# Altium schematic sheet SD_Card_Reader.SchDoc: RP2040 CNC
size B; Author: AM; CompanyName: Expatria Technologies; DrawnBy: A.Marles; Engineer: AM; Organization: Expatria Technolgoies; Address1: 1136 Glade Court; Address3: Port Coquitlam, BC V3B 1R5; Address4: Canada; DocumentNumber: 28; SheetNumber: 28; SheetTotal: 30
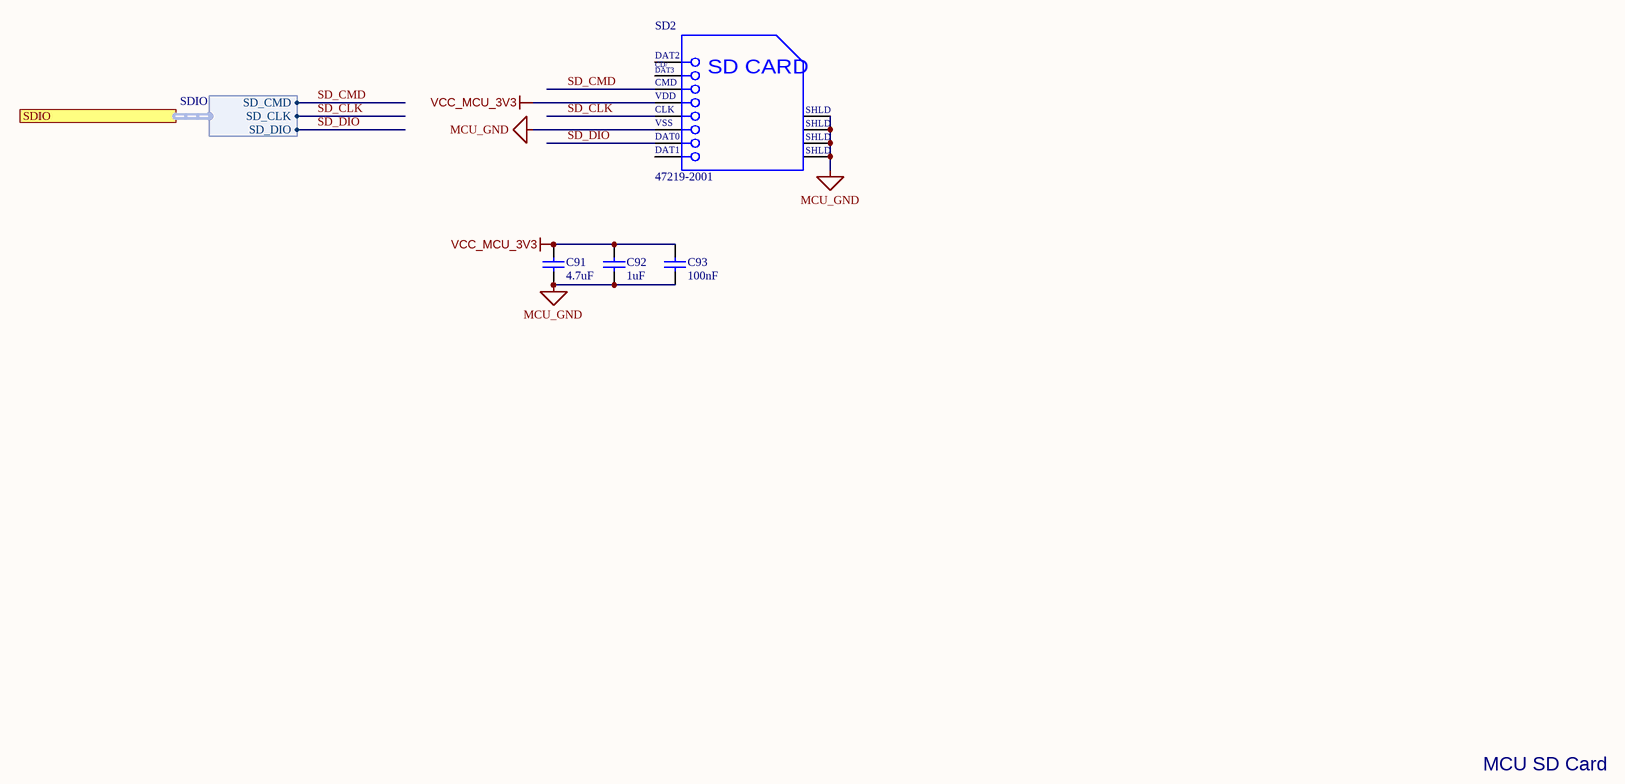
[diagram p0: SD_Card_Reader.SchDoc]

## Parts
C91  4.7uF  [0603_C]
C92  1uF  [0603_C]
C93  100nF  [0603_C]
SD2  47219-2001  [472192001]

## Ports
SDIO (harness SDIO)

## Harnesses
SDIO: SD_CMD, SD_CLK, SD_DIO

## Nets
MCU_GND: C91.1 C92.1 C93.1 SD2.6(VSS) SD2.9(SHLD) SD2.10(SHLD) SD2.11(SHLD) SD2.12(SHLD)
VCC_MCU_3V3: C91.2 C92.2 C93.2 SD2.4(VDD)
SD_CLK: SD2.5(CLK) ; port SDIO.SD_CLK
SD_CMD: SD2.3(CMD) ; port SDIO.SD_CMD
SD_DIO: SD2.7(DAT0) ; port SDIO.SD_DIO

Not connected (* = marked no-connect by the designer): SD2 1(DAT2) 2(CD/DAT3) 8(DAT1)

## Notes on the sheet
- MCU SD Card
- SHEET
- Expatria Technologies
- 1136 Glade Court
- Port Coquitlam, BC V3B 1R5
- PHONE: (778) 238-9336
- PROJECT
- SIZE
- ENGR
- MODIFIED
- DOCUMENT
- REV
- Copyright Expatria Technologies 2022. This document describes Open Hardware and is licensed under the CERN-OHL-S v2. No warranty is implied or expressed.
- EMAIL: info@expatria.ca
- B
- /
- (in symbol 47219-2001) CD/; DAT3; SD CARD

## Library data of the parts
C91 = 0603 4.7uF (475) 10% 16V: Chip capacitors; Manufacturer: Samsung Electro-Mechanics; PartNumber: CL10A475KO8NNNC; Tolerance: 10%; Voltage: 16V; ComponentLink1Description: Supplier link; ComponentLink1URL: http://www.szlcsc.com/product/details_20375.html; Package: 0603; Supplier: LCSC; SuppliersPartNumber: C19666; Capacitance: 4.7uF; Manufacturer Part Number: CL10A475KO8NNNC
C92 = 0603 1uF (105) 10% 50V: Chip capacitors; Manufacturer: Samsung Electro-Mechanics; Manufacturer Part Number: CL10A105KB8NNNC; Tolerance: 10%; Voltage: 50V; ComponentLink1Description: Supplier link; ComponentLink1URL: http://www.szlcsc.com/product/details_16531.html; Package: 0603; Supplier: LCSC; SuppliersPartNumber: C15849; Capacitance: 1uF
C93 = 0603 100nF (104) 10% 50V: Chip capacitors; Manufacturer: YAGEO; Manufacturer Part Number: CC0603KRX7R9BB104; Tolerance: 10%; Voltage: 50V; ComponentLink1Description: Supplier link; ComponentLink1URL: http://www.szlcsc.com/product/details_15331.html; Package: 0603; Supplier: LCSC; SuppliersPartNumber: C14663; Capacitance: 100nF
SD2 = 47219-2001: Conn Micro SD Card SKT 8 POS 1.1mm Solder RA SMD 0.5A/Contact Embossed T/R; Manufacturer: Molex; Manufacturer Part Number 1: 0472192001; Current Rating: 500mA; Number of Contacts: 8; Pitch: 1.09mm; Insertion - Extraction Style: Hinged; Voltage Rating: 100VDC; Voltage Rating (DC): 100V; Gender: Female; Shielding: Shielded; Product: CardConnectors; Contact Material: CopperAlloy; Series: 47219; Packaging: Reel; Brand: Molex; Product Category: MemoryCardConnectors; Housing Material: Thermoplastic; Mounting Style: SMD/SMT; Termination Style: SMD; Datasheet Version: Rev. F, 06/2009; Card Type: microSD; Manufacturer URL: http://www.molex.com/; RoHS: Details; Datasheet URL: http://www.molex.com/pdm_docs/sd/472192001_sd.pdf; Factory Pack Quantity: 2400; Manufacturer Part Number: 47219-2001; Supplier 1: LCSC; Supplier Part Number 1: C164170; Category: Memory Connectors; Stock 1: 22700; Pricing 1: 1=0.573200, 10=0.487200, 30=0.425200, 100=0.375300, 500=0.359800, 800=0.308400 (AUD); Mount: Surface Mount; Contact Plating: Gold; Color: Black; Material: Thermoplastic; Min Operating Temperature: -20°C; Max Operating Temperature: 85°C; Orientation: Horizontal; Package Quantity: 2400; Termination: SMD/SMT; Number of Circuits: 8; Length: 13.6mm; Width: 14.5mm; Depth: 1.9mm; Radiation Hardening: No; RoHS Compliant: Yes; Lead Free: Lead Free; Halogen Free: Low Halogen; ELV: Compliant; ComponentLink1URL: https://datasheet.ciiva.com/30153/0472192001-memory-card-socket-30153816.pdf?src-supplier=Onlinecomponents.com; ComponentLink1Description: https://datasheet.ciiva.com/30153/0472192001-memory-card-socket-30153816.pdf?src-supplier=Onlinecomponents.com; ComponentLink2URL: https://datasheet.ciiva.com/24444/260460472192001-memory-card-socket-24444480.pdf?src-supplier=Onlinecomponents.com; ComponentLink2Description: https://datasheet.ciiva.com/24444/260460472192001-memory-card-socket-24444480.pdf?src-supplier=Onlinecomponents.com; ComponentLink3URL: https://datasheet.ciiva.com/16655/0472192001-memory-card-socket-16655591.pdf?; ComponentLink3Description: https://datasheet.ciiva.com/16655/0472192001-memory-card-socket-16655591.pdf?; SuppliersPartNumber: C164170; Supplier: LCSC